# Altium project SUBBOARD-voltage_sensors.PrjPcb (part 1 of 2)
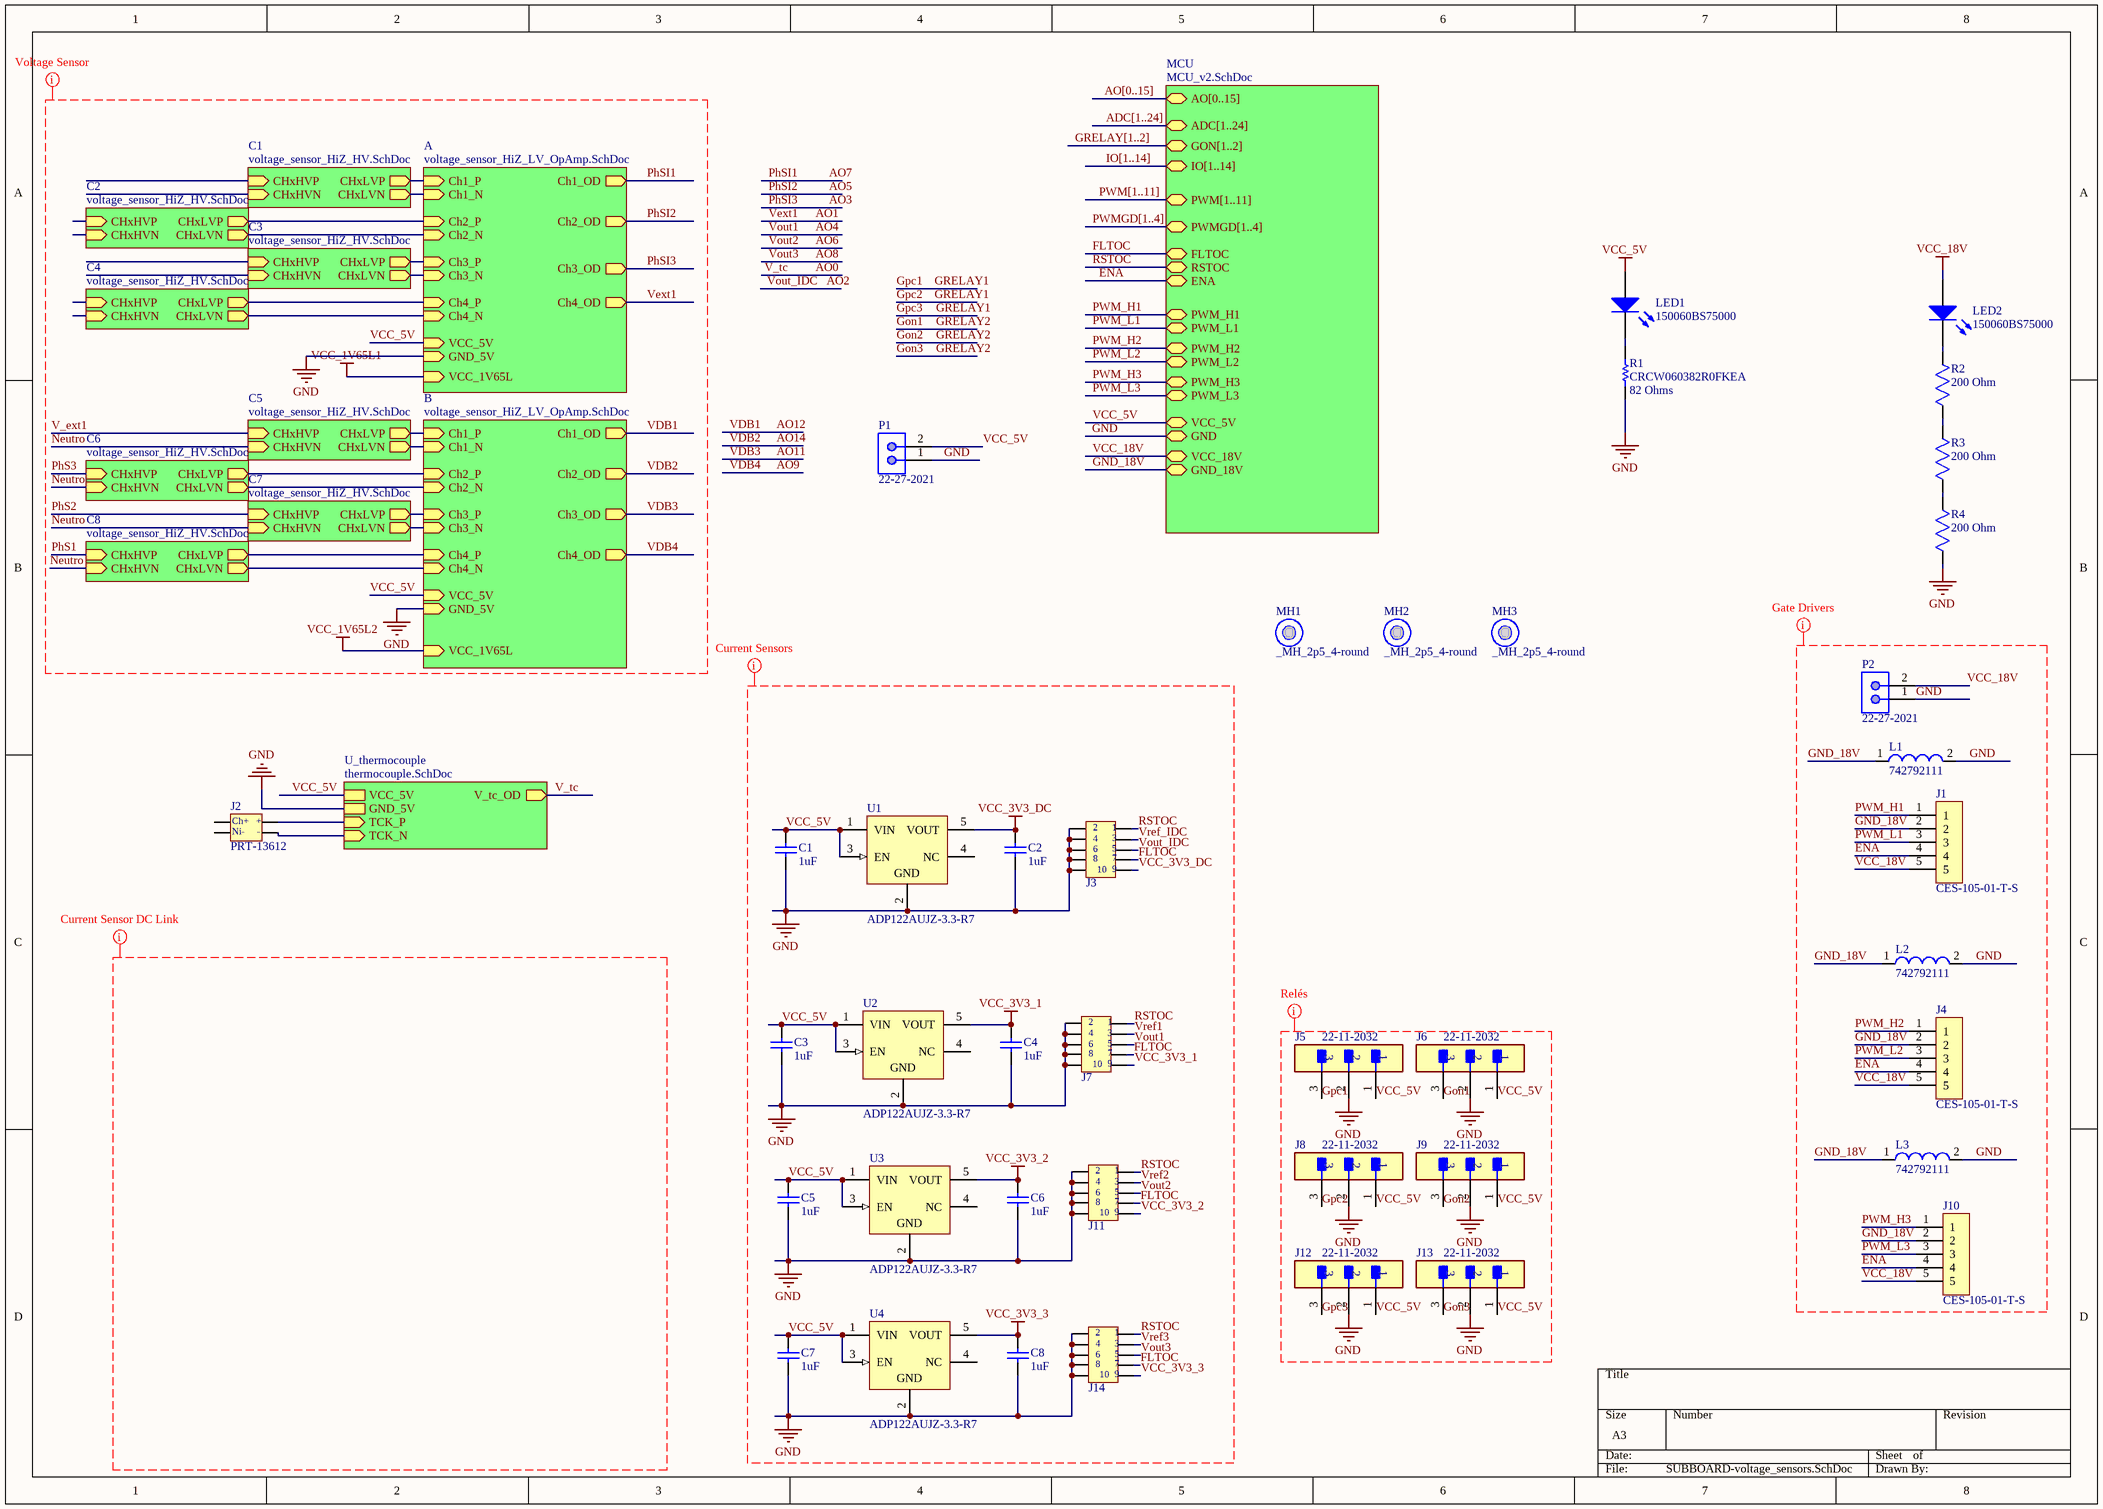
[diagram p0: SUBBOARD-voltage_sensors.SchDoc]
5 sheets, 236 parts. Net scope: hierarchical (ports join the sheet entries above them; power ports are global).
Board file: SUBBOARD-voltage_sensors.PcbDoc
Sheets:
  SUBBOARD-voltage_sensors.SchDoc
    A = voltage_sensor_HiZ_LV_OpAmp.SchDoc
    C1 = voltage_sensor_HiZ_HV.SchDoc
    C2 = voltage_sensor_HiZ_HV.SchDoc
    C3 = voltage_sensor_HiZ_HV.SchDoc
    C4 = voltage_sensor_HiZ_HV.SchDoc
    C5 = voltage_sensor_HiZ_HV.SchDoc
    C6 = voltage_sensor_HiZ_HV.SchDoc
    C7 = voltage_sensor_HiZ_HV.SchDoc
    C8 = voltage_sensor_HiZ_HV.SchDoc
    B = voltage_sensor_HiZ_LV_OpAmp.SchDoc
    MCU = MCU_v2.SchDoc
    U_thermocouple = thermocouple.SchDoc

## Sheet SUBBOARD-voltage_sensors.SchDoc
size A3

### Parts
C1  value 1uF  [CAPC0603(1608)100_N]  (hidden comment: CAP 1uF 50V 0603(1608))
C2  value 1uF  [CAPC0603(1608)100_N]  (hidden comment: CAP 1uF 50V 0603(1608))
C3  value 1uF  [CAPC0603(1608)100_N]  (hidden comment: CAP 1uF 50V 0603(1608))
C4  value 1uF  [CAPC0603(1608)100_N]  (hidden comment: CAP 1uF 50V 0603(1608))
C5  value 1uF  [CAPC0603(1608)100_N]  (hidden comment: CAP 1uF 50V 0603(1608))
C6  value 1uF  [CAPC0603(1608)100_N]  (hidden comment: CAP 1uF 50V 0603(1608))
C7  value 1uF  [CAPC0603(1608)100_N]  (hidden comment: CAP 1uF 50V 0603(1608))
C8  value 1uF  [CAPC0603(1608)100_N]  (hidden comment: CAP 1uF 50V 0603(1608))
J1  CES-105-01-T-S  [CES-105-01-T-S]
J2  PRT-13612  [PRT-13612]
J3  0878311020  [0878311020]  (value not drawn)
J4  CES-105-01-T-S  [CES-105-01-T-S]
J5  22-11-2032  [FP-22-11-2032-MFG]
J6  22-11-2032  [FP-22-11-2032-MFG]
J7  0878311020  [0878311020]  (value not drawn)
J8  22-11-2032  [FP-22-11-2032-MFG]
J9  22-11-2032  [FP-22-11-2032-MFG]
J10  CES-105-01-T-S  [CES-105-01-T-S]
J11  0878311020  [0878311020]  (value not drawn)
J12  22-11-2032  [FP-22-11-2032-MFG]
J13  22-11-2032  [FP-22-11-2032-MFG]
J14  0878311020  [0878311020]  (value not drawn)
L1  742792111  [SMD-1206]
L2  742792111  [SMD-1206]
L3  742792111  [SMD-1206]
LED1  150060BS75000  [0603_A]
LED2  150060BS75000  [0603_A]
MH1  _MH_2p5_4-round  [_MH_2p5_4-round]
MH2  _MH_2p5_4-round  [_MH_2p5_4-round]
MH3  _MH_2p5_4-round  [_MH_2p5_4-round]
P1  22-27-2021  [MOLX-22-27-2021_V]
P2  22-27-2021  [MOLX-22-27-2021_V]
R1  CRCW060382R0FKEA  value 82 Ohms  [RESC1609X50X30LL10T20]
R2  200 Ohm  [CRCW0603200RFKEAHP]
R3  200 Ohm  [CRCW0603200RFKEAHP]
R4  200 Ohm  [CRCW0603200RFKEAHP]
U1  ADP122AUJZ-3.3-R7  [ADI-UJ-5_N]
U2  ADP122AUJZ-3.3-R7  [ADI-UJ-5_N]
U3  ADP122AUJZ-3.3-R7  [ADI-UJ-5_N]
U4  ADP122AUJZ-3.3-R7  [ADI-UJ-5_N]

### Sub-sheets
A = voltage_sensor_HiZ_LV_OpAmp.SchDoc: VCC_5V (in), GND_5V (in), Ch1_OD (out), Ch2_OD (out), Ch3_OD (out), Ch4_OD (out), Ch1_N (in), Ch1_P (in), Ch2_N (in), Ch2_P (in), Ch3_N (in), Ch3_P (in), Ch4_N (in), Ch4_P (in), VCC_1V65L (in)
B = voltage_sensor_HiZ_LV_OpAmp.SchDoc: VCC_5V (in), GND_5V (in), Ch1_OD (out), Ch2_OD (out), Ch3_OD (out), Ch4_OD (out), Ch1_N (in), Ch1_P (in), Ch2_N (in), Ch2_P (in), Ch3_N (in), Ch3_P (in), Ch4_N (in), Ch4_P (in), VCC_1V65L (in)
C1 = voltage_sensor_HiZ_HV.SchDoc: CHxLVP (out), CHxHVN (in), CHxLVN (out), CHxHVP (in)
C2 = voltage_sensor_HiZ_HV.SchDoc: CHxLVP (out), CHxHVN (in), CHxLVN (out), CHxHVP (in)
C3 = voltage_sensor_HiZ_HV.SchDoc: CHxLVP (out), CHxHVN (in), CHxLVN (out), CHxHVP (in)
C4 = voltage_sensor_HiZ_HV.SchDoc: CHxLVP (out), CHxHVN (in), CHxLVN (out), CHxHVP (in)
C5 = voltage_sensor_HiZ_HV.SchDoc: CHxLVP (out), CHxHVN (in), CHxLVN (out), CHxHVP (in)
C6 = voltage_sensor_HiZ_HV.SchDoc: CHxLVP (out), CHxHVN (in), CHxLVN (out), CHxHVP (in)
C7 = voltage_sensor_HiZ_HV.SchDoc: CHxLVP (out), CHxHVN (in), CHxLVN (out), CHxHVP (in)
C8 = voltage_sensor_HiZ_HV.SchDoc: CHxLVP (out), CHxHVN (in), CHxLVN (out), CHxHVP (in)
MCU = MCU_v2.SchDoc: ADC[1..24] (bidir), IO[1..14] (bidir), PWM[1..11] (bidir), PWMGD[1..4] (bidir), ENA (bidir), PWM_H1 (bidir), PWM_L1 (bidir), PWM_H2 (bidir), PWM_L2 (bidir), PWM_H3 (bidir), PWM_L3 (bidir), VCC_5V (bidir), GND (bidir), VCC_18V (bidir), GND_18V (bidir), RSTOC (bidir), FLTOC (bidir), AO[0..15] (bidir), GON[1..2] (bidir)
U_thermocouple = thermocouple.SchDoc: V_tc_OD (out), VCC_5V, GND_5V, TCK_P (in), TCK_N (in)

### Nets
GND: C1.1 C2.1 C3.1 C4.1 C5.1 C6.1 C7.1 C8.1 J3.2 J3.4 J3.6 J3.8 J3.10 J5.2 J6.2 J7.2 J7.4 J7.6 J7.8 J7.10 J8.2 J9.2 J11.2 J11.4 J11.6 J11.8 J11.10 J12.2 J13.2 J14.2 J14.4 J14.6 J14.8 J14.10 L1.2 L2.2 L3.2 P1.1 P2.1 R1.2 R4.1 U1.2(GND) U2.2(GND) U3.2(GND) U4.2(GND) ; sheet A/GND_5V, sheet B/GND_5V, sheet MCU/GND, sheet U_thermocouple/GND_5V
VCC_1V65L1: sheet A/VCC_1V65L, sheet B/VCC_1V65L  [also labelled VCC_1V65L2]  [project net VCC_1V65L]
VCC_3V3_1: C4.2 J7.9 U2.5(VOUT)
VCC_3V3_2: C6.2 J11.9 U3.5(VOUT)
VCC_3V3_3: C8.2 J14.9 U4.5(VOUT)
VCC_3V3_DC: C2.2 J3.9 U1.5(VOUT)
VCC_5V: C1.2 C3.2 C5.2 C7.2 J5.1 J6.1 J8.1 J9.1 J12.1 J13.1 LED1.2(A) P1.2 U1.1(VIN) U1.3(EN) U2.1(VIN) U2.3(EN) U3.1(VIN) U3.3(EN) U4.1(VIN) U4.3(EN) ; sheet A/VCC_5V, sheet B/VCC_5V, sheet MCU/VCC_5V, sheet U_thermocouple/VCC_5V
VCC_18V: J1.5 J4.5 J10.5 LED2.2(A) P2.2 ; sheet MCU/VCC_18V
AO2: J3.5  [also labelled Vout_IDC]
AO4: J7.5  [also labelled Vout1]
AO6: J11.5  [also labelled Vout2]
AO8: J14.5  [also labelled Vout3]
Ch1_N: sheet A/Ch1_N, sheet C1/CHxLVN
Ch1_N: sheet C5/CHxLVN, sheet B/Ch1_N  [a separate net that carries the same name]
Ch1_P: sheet A/Ch1_P, sheet C1/CHxLVP
Ch1_P: sheet C5/CHxLVP, sheet B/Ch1_P  [a separate net that carries the same name]
Ch2_N: sheet A/Ch2_N, sheet C2/CHxLVN
Ch2_N: sheet C6/CHxLVN, sheet B/Ch2_N  [a separate net that carries the same name]
Ch2_P: sheet A/Ch2_P, sheet C2/CHxLVP
Ch2_P: sheet C6/CHxLVP, sheet B/Ch2_P  [a separate net that carries the same name]
Ch3_N: sheet A/Ch3_N, sheet C3/CHxLVN
Ch3_N: sheet C7/CHxLVN, sheet B/Ch3_N  [a separate net that carries the same name]
Ch3_P: sheet A/Ch3_P, sheet C3/CHxLVP
Ch3_P: sheet C7/CHxLVP, sheet B/Ch3_P  [a separate net that carries the same name]
Ch4_N: sheet A/Ch4_N, sheet C4/CHxLVN
Ch4_N: sheet C8/CHxLVN, sheet B/Ch4_N  [a separate net that carries the same name]
Ch4_P: sheet A/Ch4_P, sheet C4/CHxLVP
Ch4_P: sheet C8/CHxLVP, sheet B/Ch4_P  [a separate net that carries the same name]
ENA: J1.4 J4.4 J10.4 ; sheet MCU/ENA
FLTOC: J3.7 J7.7 J11.7 J14.7 ; sheet MCU/FLTOC
GND_18V: J1.2 J4.2 J10.2 L1.1 L2.1 L3.1 ; sheet MCU/GND_18V
Gon1: J6.3 J9.3 J13.3  [also labelled Gon2, Gon3, GRELAY2]
Gpc1: J5.3 J8.3 J12.3  [also labelled Gpc2, Gpc3, GRELAY1]  [project net GON1]
Neutro: sheet C5/CHxHVN, sheet C6/CHxHVN, sheet C7/CHxHVN, sheet C8/CHxHVN
PWM_H1: J1.1 ; sheet MCU/PWM_H1
PWM_H2: J4.1 ; sheet MCU/PWM_H2
PWM_H3: J10.1 ; sheet MCU/PWM_H3
PWM_L1: J1.3 ; sheet MCU/PWM_L1
PWM_L2: J4.3 ; sheet MCU/PWM_L2
PWM_L3: J10.3 ; sheet MCU/PWM_L3
RSTOC: J3.1 J7.1 J11.1 J14.1 ; sheet MCU/RSTOC
TCK_N: J2.4 ; sheet U_thermocouple/TCK_N
TCK_P: J2.3 ; sheet U_thermocouple/TCK_P
Vref1: J7.3
Vref2: J11.3
Vref3: J14.3
Vref_IDC: J3.3
NetLED1_1: LED1.1(K) R1.1
NetLED2_1: LED2.1(K) R2.2
NetR2_1: R2.1 R3.2
NetR3_1: R3.1 R4.2

Not connected (* = marked no-connect by the designer): J2 1 2; U1 4(NC); U2 4(NC); U3 4(NC); U4 4(NC)

### Buses and harness runs
bus ADC[1..24] = sheet MCU/ADC[1..24]
bus AO[0..15] = sheet MCU/AO[0..15]
bus GRELAY[1..2] = sheet MCU/GON[1..2]
bus IO[1..14] = sheet MCU/IO[1..14]
bus PWM[1..11] = sheet MCU/PWM[1..11]
bus PWMGD[1..4] = sheet MCU/PWMGD[1..4]

### Layout directives
mark named Current Sensors: FLTOC, GND, RSTOC, VCC_3V3_1, VCC_3V3_2, VCC_3V3_3, VCC_3V3_DC, VCC_5V, Vout1, Vout2, Vout3, Vout_IDC, Vref1, Vref2, Vref3, Vref_IDC
mark named Relés: GND, Gon1, Gon2, Gon3, Gpc1, Gpc2, Gpc3, VCC_5V
mark named Current Sensor DC Link: (no net found under the mark)
mark named Voltage Sensor: GND, Neutro, PhS1, PhS2, PhS3, PhSI1, PhSI2, PhSI3, V_ext1, VCC_1V65L1, VCC_1V65L2, VCC_5V, VDB1, VDB2, VDB3, VDB4, Vext1
mark named Gate Drivers: ENA, GND, GND_18V, PWM_H1, PWM_H2, PWM_H3, PWM_L1, PWM_L2, PWM_L3, VCC_18V

### Notes on the sheet
- (in symbol PRT-13612) Ch+; +; Ni-; -

### Library data of the parts
C1-C8 = CMP-1035-02746-1: CAP 1uF 50V ±20% 0603 (1608 Metric) Thickness 1mm SMD; Tolerance: Â±20%; Case-EIA: 0603; Case-Metric: 1608; Technology: SMT; Max Thickness: 1 mm; Rated Voltage: 50 V
J1 J4 J10 = CES-105-01-T-S: SAMTEC         CES-105-01-T-S             Board-To-Board Connector, CES Series, 5 Contacts, Receptacle, 2.54 mm, Through Hole, 1 Rows; Number of Contacts: 5; Contact Resistance: 10mR; Max Current Rating: 1A; Max Voltage Rating (AC): 400V; Pitch: 2.54mm; Manufacturer: Samtec; Manufacturer Part Number: CES-105-01-T-S; RoHS: Yes; Category: Connectors; Stock 1: 235; Pricing 1: 1=0,57000, 10=0,53600, 25=0,48280, 50=0,42920, 100=0,41120, 250=0,37548, 500=0,35760 (USD); Mount: Through Hole; Contact Plating: Tin; Housing Color: Black; Contact Material: Bronze; Color: Black; Housing Material: Polyester; Min Operating Temperature: -55°C; Max Operating Temperature: 105°C; Number of Rows: 1; Termination: Solder; Orientation: Straight; Packaging: Bulk; Package Quantity: 1; Connector Type: Receptacle; Number of Positions: 5; Gender: Receptacle; Length: 12.7mm; Depth: 3.05mm; Width: 3.05mm; Radiation Hardening: No; Lead Free: Lead Free; REACH SVHC: No SVHC; ComponentLink1URL: https://datasheet.ciiva.com/413/ces-mkt-413356.pdf?src-supplier=Digi-Key; ComponentLink1Description: https://datasheet.ciiva.com/413/ces-mkt-413356.pdf?src-supplier=Digi-Key; Supplier 1: Digi-Key; Supplier 2: Arrow; Supplier 3: Mouser; Supplier 4: Newark; Supplier Part Number 2: CES-105-01-T-S; Supplier Part Number 3: 200-CES10501TS; Supplier Part Number 4: 11P3506; Supplier Part Number 1: SAM1087-05-ND
J2 = PRT-13612: THERMOCOUPLE CONN - PCC-SMP-K; Manufacturer: SparkFun; System: Connector; Supplier 1: Digi-Key; Manufacturer Part Number: PRT-13612; RoHS: No; Stock 1: 201; Pricing 1: 1=4.38000 (USD); ComponentLink1URL: https://cdn.sparkfun.com/datasheets/Prototyping/PCC-SMP-K-datasheet.pdf?src-supplier=Digi-Key; ComponentLink1Description: https://cdn.sparkfun.com/datasheets/Prototyping/PCC-SMP-K-datasheet.pdf?src-supplier=Digi-Key; Supplier Part Number 1: 1568-1306-ND
J3 J7 J11 J14 = 0878311020: Conn Shrouded Header HDR 10 POS 2mm Solder ST Thru-Hole Milli-Grid™ Tube; Manufacturer: Molex; Number of Positions: 10; Connector Type: Male Pin; Row Spacing: 0.079inch; Supplier 1: Digi-Key; Manufacturer Part Number: 0878311020; RoHS: Yes; Category: Headers and Wire Housings; Stock 1: 7937; Pricing 1: 1=1.65000, 10=1.50100, 100=1.28650, 500=1.07206, 1000=0.91890, 5000=0.81476, 10000=0.79638 (USD); Mount: Through Hole; Contact Plating: Gold; Contact Material: Bronze; Color: Black; Housing Material: Nylon; Housing Color: Black; Min Operating Temperature: -55°C; Max Operating Temperature: 105°C; Termination: Solder; Number of Contacts: 10; Number of Rows: 2; Packaging: Rail/Tube; Orientation: Straight; Length: 12.65mm; Pitch: 2mm; Contact Mating Length: 0.141inch; Depth: 6.3mm; Radiation Hardening: No; ComponentLink1URL: https://datasheet.ciiva.com/6814/878311620-sd-6814006.pdf?src-supplier=Digi-Key; ComponentLink1Description: https://datasheet.ciiva.com/6814/878311620-sd-6814006.pdf?src-supplier=Digi-Key; Supplier Part Number 1: WM18560-ND
J5 J6 J8 J9 J12 J13 = CMP-04776-000113-1: CONN HEADER VERT 3POS 2.54MM; Manufacturer: Molex; Number Of Contacts: 3; Voltage Rating: 500V; Conn Gender: Male; Current Rating: 4A; Conn Orientation: Vertical; Device Class L2: Headers and Wire Housings; Number Of Rows: 1; Temperature Range High: +80°C; RoHS: TRUE; ComponentLink2URL: https://www.molex.com/webdocs/datasheets/pdf/en-us/0022112032_PCB_HEADERS.pdf; Manufacturer Part Number: 22-11-2032; Device Class L3: unset; Automotive: No; Temperature: -40°C to +80°C; Temperature Range Low: -40°C; Lead Free: Yes; Pitch: 2.54mm; Footprint Url: https://www.molex.com/pdm_docs/sd/022112032_sd.pdf; Digikey Description: CONN HEADER VERT 3POS 2.54MM; Contact Material: Gold,Nickel; Octopart: https://octopart.com/22-11-2032-molex-10085; Height: 10.91mm; Mouser Description: KK® 254 Solid Header, Vertical, with Friction Lock, 3 Circuits, Gold (Au) Plating; Package: 22-11-2032; Device Class L1: Connectors; Mounting Type: Through Hole; ComponentLink2Description: Datasheet; Category: Conn
L1-L3 = CMP-0220-00024-1: SMD EMI Suppression Ferrite Bead WE-CBF, Z = 26 Ohm; Impedance: 26 Ohm; ComponentLink2Description: Datasheet; PackageReference: SMD-1206; ComponentLink2URL: http://www.we-online.de/katalog/media/pdf/742792111.pdf; PackageVersion: 2007; DatasheetVersion: Dec-2005; PackageDescription: Chip Inductor, 2-Leads, Body 3.2 x 1.6 mm; ComponentLink1URL: http://www.we-online.com; ComponentLink1Description: Manufacturer Link
LED1 LED2 = CMP-1426-00003-1: SMD mono-color Chip LED, WL-SMCW, Blue; Manufacturer: Wuerth Elektronik; Color: Blue; ComponentLink2Description: Datasheet; ComponentLink2URL: http://katalog.we-online.com/led/datasheet/150060BS75000.pdf; ComponentLink1URL: http://www.we-online.com; PackageReference: 0603_A; PartNumber: 150060BS75000; ComponentLink1Description: Manufacturer URL
MH1-MH3 = _MH_2p5_4-round: matching hole 2.5 hole, 4mm pad (round)
P1 P2 = CMP-2000-05537-1: Male Header, Pitch 2.54 mm, 1 x 2 Position, Height 11.7 mm, Tail Length 3.56 mm, 0 to 75 degC, RoHS, Bulk; Manufacturer: Molex; PartNumber: 0022272021; Current rating: 4A; Package Version: Rev. BC, 02/2012; Voltage rating: 250V; No. of Positions: 2; Pitch: 2.54mm; No. of Rows: 1; Orientation: Vertical; Operating temperature: 0°Cto+75°C; Manufacturer URL: http://www.molex.com/; Mounting Technology: ThroughHole; Housing material: Nylon(UL94V-0); Package Description: 2-Leads Header, Body 5.08 x 5.8 mm, Pitch 2.54 mm; Voltage - Max: 250V; Datasheet URL: http://www.molex.com/pdm_docs/sd/022272021_sd.pdf; Package Reference: 22-27-2021; Contact material: Tinplatedbrass; Current - Max: 4A; Datasheet Version: Rev. F, 06/2009
R1 = CMP-2000-03606-1: Manufacturer: Vishay Dale; Part Number: CRCW060382R0FKEA
R2-R4 = CRCW0603200RFKEAHP: CRCW0603200RFKEAHP / Res Thick Film 0603 200 Ohm 1% 0.25W(1/4W) ±100ppm/C Pad SMD Automotive T/R; Manufacturer: Vishay Dale; Resistance: 200R; Power Rating: 250mW; Temperature Coefficient: 100ppm/°C; Supplier 1: Digi-Key; Manufacturer Part Number: CRCW0603200RFKEAHP; RoHS: Yes; Category: Chip SMD Resistors; Stock 1: 59007; Pricing 1: 1=0.15000, 10=0.12900, 100=0.05030, 1000=0.02106, 2500=0.01930 (USD); Mount: Surface Mount; Case/Package: 0603; Case Code (Imperial): 0603; Case Code (Metric): 1608; Contact Plating: Tin; Min Operating Temperature: -55°C; Max Operating Temperature: 155°C; Features: Automotive AEC-Q200; Tolerance: 1%; Packaging: Tape and Reel; Resistor Type: Thick Film; Max Power Dissipation: 250mW; Number of Terminations: 2; Package Quantity: 5000; Length: 0.063inch; Width: 0.033inch; Height: 0.022inch; Radiation Hardening: No; Lead Free: Lead Free; ComponentLink1URL: https://datasheet.ciiva.com/2578/crcwhpe3-2578537.pdf?src-supplier=Digi-Key; ComponentLink1Description: https://datasheet.ciiva.com/2578/crcwhpe3-2578537.pdf?src-supplier=Digi-Key; ComponentLink2URL: https://datasheet.ciiva.com/8961/crcwhpe3-8961129.pdf?src-supplier=Avnet; ComponentLink2Description: https://datasheet.ciiva.com/8961/crcwhpe3-8961129.pdf?src-supplier=Avnet; Supplier Part Number 1: 541-200SCT-ND
U1-U4 = CMP-0786-00346-1: 300 mA, Low Quiescent Current, CMOS Linear Regulator, 2.3 to 5.5 V Vin, 3.3 V Vout, Industrial, 5-pin SOT23 (UJ-5), Reel; Manufacturer: Analog Devices; Vin (min) (V): 2.3; Supply Current IGND @ Small Load: 45uA; Vin (max) (V): 5.5; Iout max: 300mA; Preset Vout Values (V): 3.3; ComponentLink4Description: URL Link1; ComponentLink4URL: Product URL:http://www.analog.com/en/ADP122/productSearch.html; ComponentLink2URL: http://www.analog.com/static/imported-files/data_sheets/ADP122_123.pdf; PackageDescription: 5-Pin Thin Small Outline Transistor Package, Body 2.9 x 1.6 mm, Pitch 0.95 mm; ComponentLink1URL: http://www.analog.com/en/index.html; ComponentLink3URL: http:/www.analog.com/static/imported-files/packages/PKG_PDF/TSOT(UJ)/UJ_5.pdf; ComponentLink2Description: Datasheet; PartNumber: ADP122AUJZ-3.3-R7; Packing: Reel; ComponentLink1Description: Manufacturer URL; Code_JEDEC: MO-193-AB; PackageVersion: 100708-A, 10/2008; PackageReference: UJ-5; Mounting Technology: Surface Mount; DatasheetVersion: Rev. E; ComponentLink3Description: Package Specification

## Sheet voltage_sensor_HiZ_LV_OpAmp.SchDoc
size A4
Used 2 times, as channels A, B. Parts and nets are listed once, with the designators drawn on the sheet.
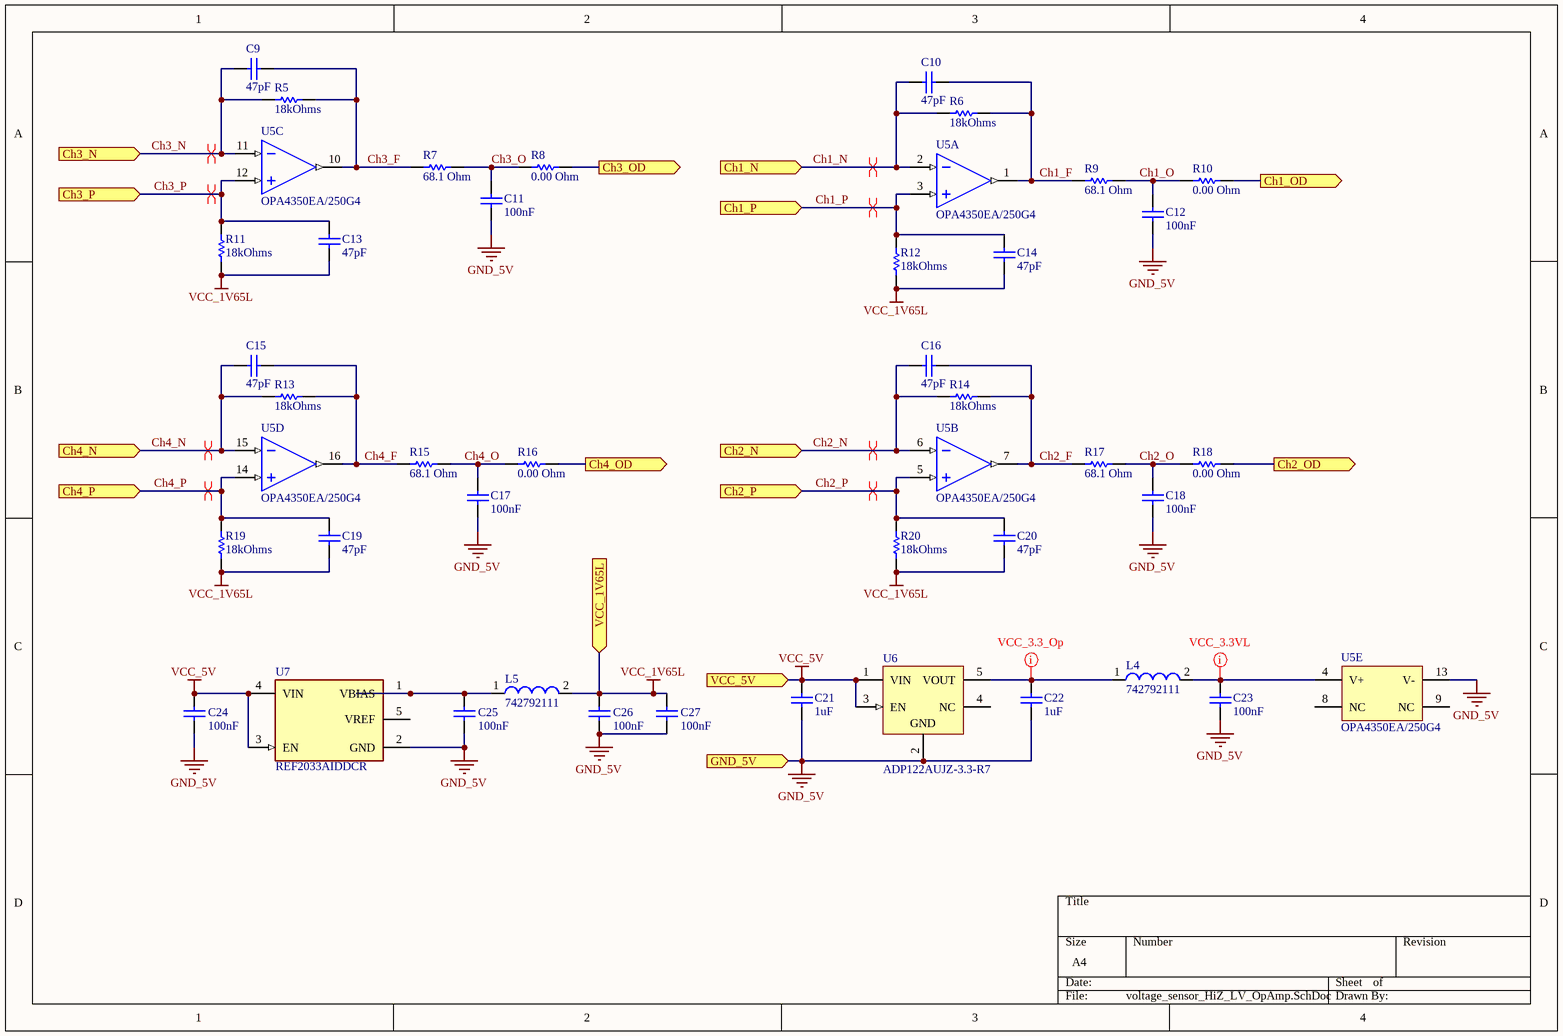
[diagram p1: voltage_sensor_HiZ_LV_OpAmp.SchDoc]

### Parts
C9  value 47pF  [CAPC0603(1608)100_L]  (hidden comment: CAP 47pF 50V 0603(1608))
C10  value 47pF  [CAPC0603(1608)100_L]  (hidden comment: CAP 47pF 50V 0603(1608))
C11  value 100nF  [CAPC0603(1608)100_L]  (hidden comment: CAP 100nF 10V 0603(1608))
C12  value 100nF  [CAPC0603(1608)100_L]  (hidden comment: CAP 100nF 10V 0603(1608))
C13  value 47pF  [CAPC0603(1608)100_L]  (hidden comment: CAP 47pF 50V 0603(1608))
C14  value 47pF  [CAPC0603(1608)100_L]  (hidden comment: CAP 47pF 50V 0603(1608))
C15  value 47pF  [CAPC0603(1608)100_L]  (hidden comment: CAP 47pF 50V 0603(1608))
C16  value 47pF  [CAPC0603(1608)100_L]  (hidden comment: CAP 47pF 50V 0603(1608))
C17  value 100nF  [CAPC0603(1608)100_L]  (hidden comment: CAP 100nF 10V 0603(1608))
C18  value 100nF  [CAPC0603(1608)100_L]  (hidden comment: CAP 100nF 10V 0603(1608))
C19  value 47pF  [CAPC0603(1608)100_L]  (hidden comment: CAP 47pF 50V 0603(1608))
C20  value 47pF  [CAPC0603(1608)100_L]  (hidden comment: CAP 47pF 50V 0603(1608))
C21  value 1uF  [CAPC0603(1608)100_N]  (hidden comment: CAP 1uF 50V 0603(1608))
C22  value 1uF  [CAPC0603(1608)100_N]  (hidden comment: CAP 1uF 50V 0603(1608))
C23  value 100nF  [CAPC0603(1608)100_L]  (hidden comment: CAP 100nF 10V 0603(1608))
C24  value 100nF  [CAPC0603(1608)100_N]  (hidden comment: CAP 100nF 10V 0603(1608))
C25  value 100nF  [CAPC0603(1608)100_N]  (hidden comment: CAP 100nF 10V 0603(1608))
C26  value 100nF  [CAPC0603(1608)100_L]  (hidden comment: CAP 100nF 10V 0603(1608))
C27  value 100nF  [CAPC0603(1608)100_L]  (hidden comment: CAP 100nF 10V 0603(1608))
L4  742792111  [SMD-1206]
L5  742792111  [SMD-1206]
R5  Resistance: 18kOhms  [RESC1608X55X25LL10T15]  (hidden comment: RC0603FR-0718KL)
R6  Resistance: 18kOhms  [RESC1608X55X25LL10T15]  (hidden comment: RC0603FR-0718KL)
R7  value 68.1 Ohm  [RESC1608X55X30LL15T15]  (hidden comment: ERJ-3EKF68R1V)
R8  value 0.00 Ohm  [RESC0603(1608)_L]  (hidden comment: Jumper 0603(1608))
R9  value 68.1 Ohm  [RESC1608X55X30LL15T15]  (hidden comment: ERJ-3EKF68R1V)
R10  value 0.00 Ohm  [RESC0603(1608)_L]  (hidden comment: Jumper 0603(1608))
R11  Resistance: 18kOhms  [RESC1608X55X25LL10T15]  (hidden comment: RC0603FR-0718KL)
R12  Resistance: 18kOhms  [RESC1608X55X25LL10T15]  (hidden comment: RC0603FR-0718KL)
R13  Resistance: 18kOhms  [RESC1608X55X25LL10T15]  (hidden comment: RC0603FR-0718KL)
R14  Resistance: 18kOhms  [RESC1608X55X25LL10T15]  (hidden comment: RC0603FR-0718KL)
R15  value 68.1 Ohm  [RESC1608X55X30LL15T15]  (hidden comment: ERJ-3EKF68R1V)
R16  value 0.00 Ohm  [RESC0603(1608)_L]  (hidden comment: Jumper 0603(1608))
R17  value 68.1 Ohm  [RESC1608X55X30LL15T15]  (hidden comment: ERJ-3EKF68R1V)
R18  value 0.00 Ohm  [RESC0603(1608)_L]  (hidden comment: Jumper 0603(1608))
R19  Resistance: 18kOhms  [RESC1608X55X25LL10T15]  (hidden comment: RC0603FR-0718KL)
R20  Resistance: 18kOhms  [RESC1608X55X25LL10T15]  (hidden comment: RC0603FR-0718KL)
U5  OPA4350EA/250G4  [TI-DBQ16_L]  (parts A,B,C,D,E of 5)
U6  ADP122AUJZ-3.3-R7  [ADI-UJ-5_N]
U7  REF2033AIDDCR  [FP-DDC0005A-IPC_C]

### Ports
Ch1_N (in), Ch1_OD (out), Ch1_P (in), Ch2_N (in), Ch2_OD (out), Ch2_P (in), Ch3_N (in), Ch3_OD (out), Ch3_P (in), Ch4_N (in), Ch4_OD (out), Ch4_P (in), GND_5V (in), VCC_1V65L (in), VCC_5V (in)

### Nets
GND_5V: C11.1 C12.1 C17.1 C18.1 C21.1 C22.1 C23.1 C24.1 C25.1 C26.1 C27.1 U5.13(V-) U6.2(GND) U7.2(GND) ; port GND_5V
VCC_1V65L: C13.2 C14.2 C19.2 C20.2 C26.2 C27.2 L5.2 R11.2 R12.2 R19.2 R20.2 ; port VCC_1V65L
VCC_5V: C21.2 C24.2 U6.1(VIN) U6.3(EN) U7.3(EN) U7.4(VIN) ; port VCC_5V
Ch1_F: C10.2 R6.1 R9.2 U5.1(OUT_A)
Ch1_N: C10.1 R6.2 U5.2(IN_A-) ; port Ch1_N
Ch1_O: C12.2 R9.1 R10.2
Ch1_OD: R10.1 ; port Ch1_OD
Ch1_P: C14.1 R12.1 U5.3(IN_A+) ; port Ch1_P
Ch2_F: C16.2 R14.1 R17.2 U5.7(OUT_B)
Ch2_N: C16.1 R14.2 U5.6(IN_B-) ; port Ch2_N
Ch2_O: C18.2 R17.1 R18.2
Ch2_OD: R18.1 ; port Ch2_OD
Ch2_P: C20.1 R20.1 U5.5(IN_B+) ; port Ch2_P
Ch3_F: C9.2 R5.1 R7.2 U5.10(OUT_C)
Ch3_N: C9.1 R5.2 U5.11(IN_C-) ; port Ch3_N
Ch3_O: C11.2 R7.1 R8.2
Ch3_OD: R8.1 ; port Ch3_OD
Ch3_P: C13.1 R11.1 U5.12(IN_C+) ; port Ch3_P
Ch4_F: C15.2 R13.1 R15.2 U5.16(OUT_D)
Ch4_N: C15.1 R13.2 U5.15(IN_D-) ; port Ch4_N
Ch4_O: C17.2 R15.1 R16.2
Ch4_OD: R16.1 ; port Ch4_OD
Ch4_P: C19.1 R19.1 U5.14(IN_D+) ; port Ch4_P
NetC22_2: C22.2 L4.1 U6.5(VOUT)
NetC23_2: C23.2 L4.2 U5.4(V+)
NetC25_2: C25.2 L5.1 U7.1(VBIAS)

Not connected (* = marked no-connect by the designer): U5 8(NC) 9(NC); U6 4(NC); U7 5(VREF)

### Channels
A: designators end in A; ports Ch1_N=Ch1_N Ch1_OD=AO7 Ch1_P=Ch1_P Ch2_N=Ch2_N Ch2_OD=AO5 Ch2_P=Ch2_P Ch3_N=Ch3_N Ch3_OD=AO3 Ch3_P=Ch3_P Ch4_N=Ch4_N Ch4_OD=AO1 Ch4_P=Ch4_P GND_5V=GND VCC_1V65L=VCC_1V65L VCC_5V=VCC_5V
B: designators end in B; ports Ch1_N=Ch1_N Ch1_OD=AO12 Ch1_P=Ch1_P Ch2_N=Ch2_N Ch2_OD=AO14 Ch2_P=Ch2_P Ch3_N=Ch3_N Ch3_OD=AO11 Ch3_P=Ch3_P Ch4_N=Ch4_N Ch4_OD=AO9 Ch4_P=Ch4_P GND_5V=GND VCC_1V65L=VCC_1V65L VCC_5V=VCC_5V

### Layout directives
differential pair: Ch1_N, Ch1_P, Ch2_N, Ch2_P, Ch3_N, Ch3_P, Ch4_N, Ch4_P
mark named VCC_3.3_Op: NetC22A_2
mark named VCC_3.3VL: NetC23A_2

### Library data of the parts
C9 C10 C13-C16 C19 C20 = CMP-1035-01063-1: CAP 47pF 50V ±5% 0603 (1608 Metric) Thickness 1mm SMD; Case-EIA: 0603; Tolerance: Â±5%; Case-Metric: 1608; Technology: SMT; Max Thickness: 1 mm; Rated Voltage: 50 V
C11 C12 C17 C18 C23-C27 = CMP-1035-02580-1: CAP 100nF 10V ±10% 0603 (1608 Metric) Thickness 1mm SMD; Tolerance: Â±10%; Case-EIA: 0603; Case-Metric: 1608; Max Thickness: 1 mm; Rated Voltage: 10 V; Technology: SMT
C21 C22 = CMP-1035-02746-1: as C1 on sheet SUBBOARD-voltage_sensors; Technology: SMT; Max Thickness: 1 mm; Rated Voltage: 50 V
L4 L5 = CMP-0220-00024-1: as L1 on sheet SUBBOARD-voltage_sensors; ComponentLink2Description: Datasheet; PackageReference: SMD-1206; ComponentLink2URL: http://www.we-online.de/katalog/media/pdf/742792111.pdf; PackageVersion: 2007; DatasheetVersion: Dec-2005; PackageDescription: Chip Inductor, 2-Leads, Body 3.2 x 1.6 mm; ComponentLink1URL: http://www.we-online.com; ComponentLink1Description: Manufacturer Link
R5 R6 R11-R14 R19 R20 = CMP-2000-06930-1: Chip Resistor, 18 KOhm, +/- 1%, 0.1 W, -55 to 155 degC, 0603 (1608 Metric), RoHS, Tape and Reel; Manufacturer: Yageo; Voltage Rating: 75V; Temperature Coefficient: 100PPM/C; Unit Weight: 0.000071oz; Power Rating: 100mW; Datasheet URL: http://www.yageo.com/documents/recent/PYu-RC_Group_51_RoHS_L_7.pdf; Packaging: Reel; Series: RC; Datasheet Version: Rev. 7, 05/2017; Type: GeneralPurposeChipResistorSurfaceMount; Termination Style: SMD/SMT; Package Reference: 0603; Operating Temperature Range: -55Cto+155C; Mounting Technology: SurfaceMount; Tolerance: 1%; Height: 0.45mm; Length: 1.6mm; Case Code - mm: 1608; Product: ThickFilmResistorsGeneralPurpose; RoHS: True; Product Category: ThickFilmResistors; Case Code - in: 0603; Brand: Yageo; Manufacturer URL: http://www.yageo.com/; Width: 0.8mm; Package / Case: 0603(1608metric); Package Description: 2-Pin Surface Mount Device, Body 1.6 x 0.8 mm
R7 R9 R15 R17 = CMP-2000-00621-1: Manufacturer: Panasonic; Tolerance: 1%; Part Number: ERJ-3EKF68R1V; Package: 0603
R8 R10 R16 R18 = CMP-1012-00001-1: Jumper 0603 (1608 Metric); Case-Metric: 1608; Power: None; Case-EIA: 0603; Technology: SMT; Tolerance: None
U5 = CMP-0272-00834-2: High-Speed, Single-Supply, Rail-to-Rail Operational Amplifier MicroAmplifier(TM) Series, 2.7 to 5.5 V, -55 to 150 degC, 16-pin SOP (DBQ16), Green (RoHS & no Sb/Br); Manufacturer: Texas Instruments; Iq per channel(Max)(mA): 7.5; Slew Rate(Typ)(V/us): 22; Sub Family: Low Input Bias Current Amp (<=10pA), Low Offset Voltage Amplifier (<=500uV), Low Supply Voltage Amplifier (<=2.7V), Precision Amplifier; Vn at 1kHz(Typ)(nV/rtHz): 18; CMRR(Min)(dB): 66; Offset Drift(Typ)(uV/C): 4; Vio (25C)(Max)(mV): 0.5; Total Supply Voltage(Min)(+5V is 5, +/-5V is 10): 2.7; IIB(Max)(pA): 10; Total Supply Voltage(Max)(+5V is 5, +/-5V is 10): 5.5; Eco-Plan: Green (RoHS & no Sb/Br); PackageVersion: 4073301-2/H, 10/2008; ComponentLink1Description: Manufacturer URL; ComponentLink2Description: Datasheet; Mounting Technology: Surface Mount; ComponentLink3Description: Package Specification; PackageReference: DBQ16; PartNumber: OPA4350EA/250G4; ComponentLink2URL: http://www.ti.com/general/docs/lit/getliterature.tsp?genericPartNumber=OPA4350&fileType=pdf; ComponentLink1URL: http://www.ti.com/; Code_JEDEC: MO-137; DatasheetVersion: SBOS099C; Number of Channels: 4; ComponentLink3URL: http://www.ti.com/litv/pdf/msoi004g; PackageDescription: 16-Pin, Plastic Small Outline, Body 3.9 x 4.9 mm, Pitch 0.635 mm
U6 = CMP-0786-00346-1: as U1 on sheet SUBBOARD-voltage_sensors; ComponentLink4Description: URL Link1; ComponentLink4URL: Product URL:http://www.analog.com/en/ADP122/productSearch.html; ComponentLink2URL: http://www.analog.com/static/imported-files/data_sheets/ADP122_123.pdf; PackageDescription: 5-Pin Thin Small Outline Transistor Package, Body 2.9 x 1.6 mm, Pitch 0.95 mm; ComponentLink1URL: http://www.analog.com/en/index.html; ComponentLink3URL: http:/www.analog.com/static/imported-files/packages/PKG_PDF/TSOT(UJ)/UJ_5.pdf; ComponentLink2Description: Datasheet; PartNumber: ADP122AUJZ-3.3-R7; Packing: Reel; ComponentLink1Description: Manufacturer URL; Code_JEDEC: MO-193-AB; PackageVersion: 100708-A, 10/2008; PackageReference: UJ-5; Mounting Technology: Surface Mount; DatasheetVersion: Rev. E; ComponentLink3Description: Package Specification
U7 = CMP-04916-000008-1: IC VREF SERIES 1.65V/3.3V 5SOT; Manufacturer: Texas Instruments; Standoff Height: 0mm; Nominal Supply Current: 360uA; Min Supply Voltage: 3.32V; Output Type: Fixed; Number Of Outputs: 2; Output Voltage: 1.65/3.3V; Output Current: 20mA; Max Supply Voltage: 5.5V; Max Junction Temp: +150°C; Automotive: No; Height: 1.1mm; Package: DDC0005A; Reference Type: Series; Manufacturer Part Number: REF2033AIDDCR; Temperature Range High: +125°C; Lead Free: Yes; ComponentLink2Description: Datasheet; Device Class L1: Integrated Circuits (ICs); Category: IC; RoHS: TRUE; Device Class L3: Voltage References; ComponentLink2URL: http://www.ti.com/lit/ds/symlink/ref2033.pdf; Device Class L2: Power Management ICs; Octopart: https://octopart.com/ref2033aiddcr-texas+instruments-46921199; Digikey Description: IC VREF SERIES 1.65V/3.3V 5SOT; Temperature: -40°C to +125°C; Temperature Range Low: -40°C

## Sheet voltage_sensor_HiZ_HV.SchDoc
size A3
Used 8 times, as channels C1, C2, C3, C4, C5, C6, C7, C8. Parts and nets are listed once, with the designators drawn on the sheet.
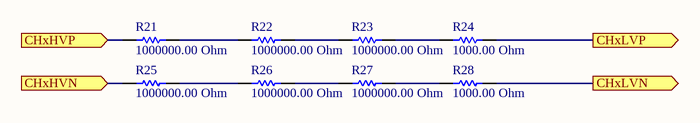
[diagram p2: voltage_sensor_HiZ_HV.SchDoc]

### Parts
R21  value 1000000.00 Ohm  [RESC1206(3216)_L]  (hidden comment: 1M 1% 1206(3216))
R22  value 1000000.00 Ohm  [RESC1206(3216)_L]  (hidden comment: 1M 1% 1206(3216))
R23  value 1000000.00 Ohm  [RESC1206(3216)_L]  (hidden comment: 1M 1% 1206(3216))
R24  value 1000.00 Ohm  [RESC1206(3216)_L]  (hidden comment: 1K 1% 1206(3216))
R25  value 1000000.00 Ohm  [RESC1206(3216)_L]  (hidden comment: 1M 1% 1206(3216))
R26  value 1000000.00 Ohm  [RESC1206(3216)_L]  (hidden comment: 1M 1% 1206(3216))
R27  value 1000000.00 Ohm  [RESC1206(3216)_L]  (hidden comment: 1M 1% 1206(3216))
R28  value 1000.00 Ohm  [RESC1206(3216)_L]  (hidden comment: 1K 1% 1206(3216))

### Ports
CHxHVN (in), CHxHVP (in), CHxLVN (out), CHxLVP (out)

### Nets
CHxHVN: R25.2 ; port CHxHVN
CHxHVP: R21.2 ; port CHxHVP
CHxLVN: R28.1 ; port CHxLVN
CHxLVP: R24.1 ; port CHxLVP
NetR21_1: R21.1 R22.2
NetR22_1: R22.1 R23.2
NetR23_1: R23.1 R24.2
NetR25_1: R25.1 R26.2
NetR26_1: R26.1 R27.2
NetR27_1: R27.1 R28.2

### Channels
C1: designators end in A; ports CHxHVN=NetR25A_2 CHxHVP=NetR21A_2 CHxLVN=Ch1_N CHxLVP=Ch1_P
C2: designators end in B; ports CHxHVN=NetR25B_2 CHxHVP=NetR21B_2 CHxLVN=Ch2_N CHxLVP=Ch2_P
C3: designators end in C; ports CHxHVN=NetR25C_2 CHxHVP=NetR21C_2 CHxLVN=Ch3_N CHxLVP=Ch3_P
C4: designators end in D; ports CHxHVN=NetR25D_2 CHxHVP=NetR21D_2 CHxLVN=Ch4_N CHxLVP=Ch4_P
C5: designators end in E; ports CHxHVN=Neutro CHxHVP=V_ext1 CHxLVN=Ch1_N CHxLVP=Ch1_P
C6: designators end in F; ports CHxHVN=Neutro CHxHVP=PhS3 CHxLVN=Ch2_N CHxLVP=Ch2_P
C7: designators end in G; ports CHxHVN=Neutro CHxHVP=PhS2 CHxLVN=Ch3_N CHxLVP=Ch3_P
C8: designators end in H; ports CHxHVN=Neutro CHxHVP=PhS1 CHxLVN=Ch4_N CHxLVP=Ch4_P

### Library data of the parts
R21-R23 R25-R27 = CMP-1014-00849-1: 1M 0.25W 1% 1206 (3216 Metric)  SMD; Case-EIA: 1206; Case-Metric: 3216; Tolerance: 1 %; Power: 0.25 W; Technology: SMT
R24 R28 = CMP-1014-00510-1: 1K 0.25W 1% 1206 (3216 Metric)  SMD; Case-Metric: 3216; Case-EIA: 1206; Power: 0.25 W; Tolerance: 1 %; Technology: SMT

## Sheet MCU_v2.SchDoc
size A3
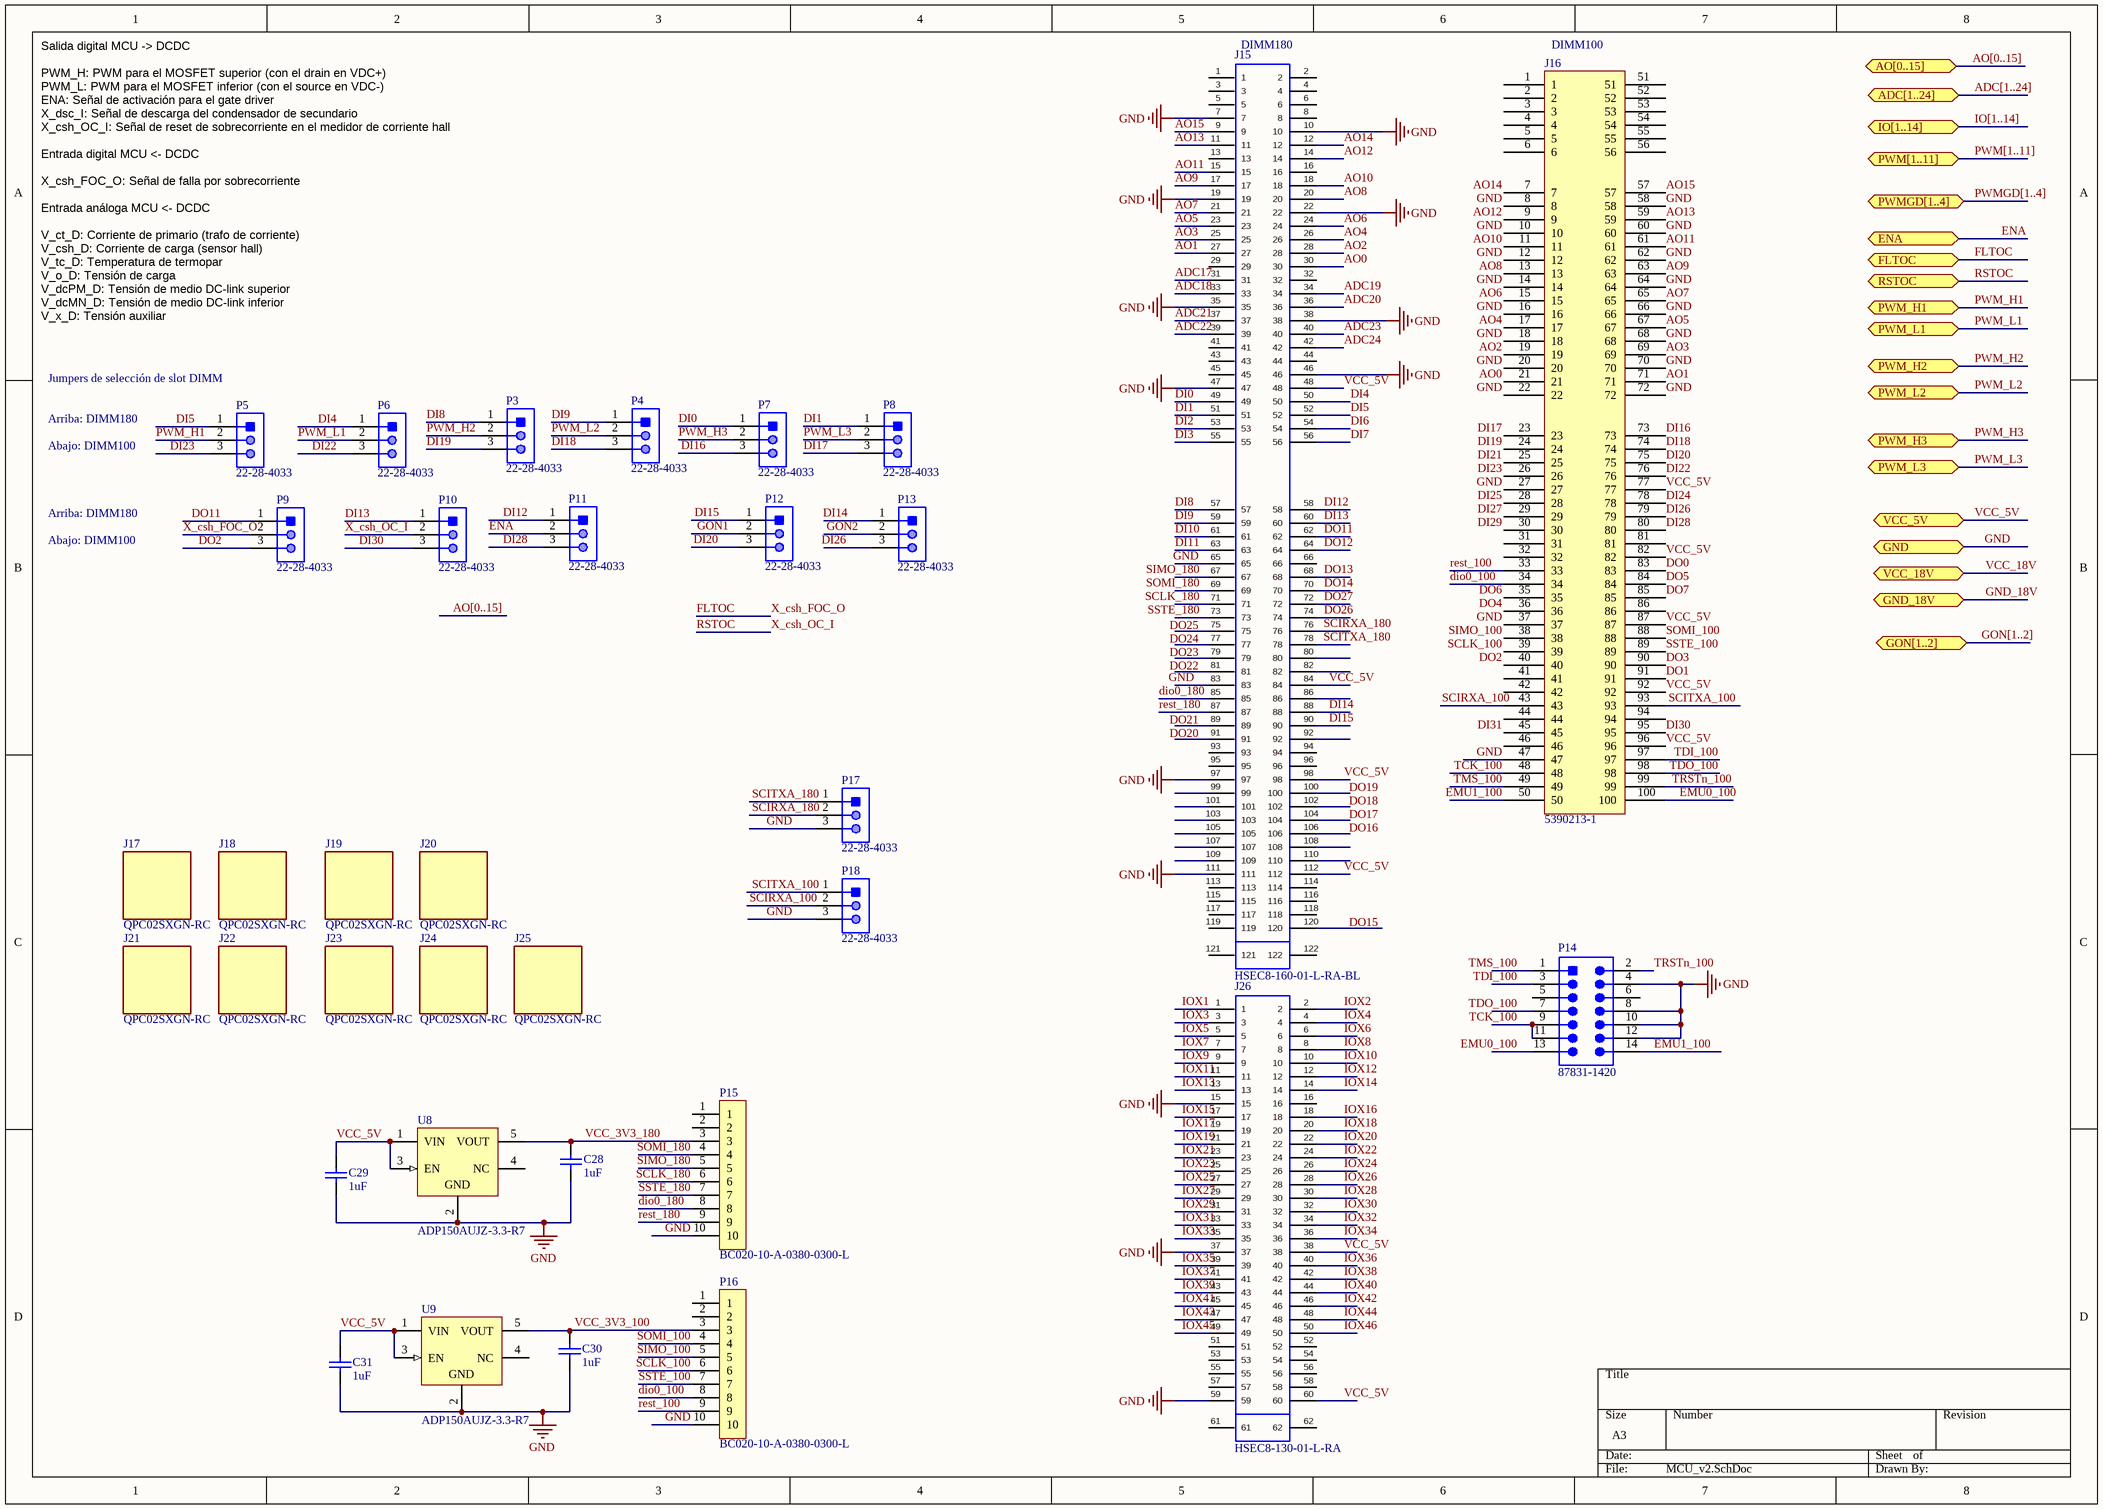
[diagram p3: MCU_v2.SchDoc]

### Parts
C28  value 1uF  [CAPC0603(1608)100_N]  (hidden comment: CAP 1uF 50V 0603(1608))
C29  value 1uF  [CAPC0603(1608)100_N]  (hidden comment: CAP 1uF 50V 0603(1608))
C30  value 1uF  [CAPC0603(1608)100_N]  (hidden comment: CAP 1uF 50V 0603(1608))
C31  value 1uF  [CAPC0603(1608)100_N]  (hidden comment: CAP 1uF 50V 0603(1608))
J15  HSEC8-160-01-L-RA-BL  [HSEC8-160-01-L-RA-BL]
J16  5390213-1  [TE_5390213-1]
J17  QPC02SXGN-RC  [FP-QPC02SXGN-RC-MFG]
J18  QPC02SXGN-RC  [FP-QPC02SXGN-RC-MFG]
J19  QPC02SXGN-RC  [FP-QPC02SXGN-RC-MFG]
J20  QPC02SXGN-RC  [FP-QPC02SXGN-RC-MFG]
J21  QPC02SXGN-RC  [FP-QPC02SXGN-RC-MFG]
J22  QPC02SXGN-RC  [FP-QPC02SXGN-RC-MFG]
J23  QPC02SXGN-RC  [FP-QPC02SXGN-RC-MFG]
J24  QPC02SXGN-RC  [FP-QPC02SXGN-RC-MFG]
J25  QPC02SXGN-RC  [FP-QPC02SXGN-RC-MFG]
J26  HSEC8-130-01-L-RA  [HSEC8-130-01-L-RA]
P3  22-28-4033  [MOLX-22-28-4033_V]
P4  22-28-4033  [MOLX-22-28-4033_V]
P5  22-28-4033  [MOLX-22-28-4033_V]
P6  22-28-4033  [MOLX-22-28-4033_V]
P7  22-28-4033  [MOLX-22-28-4033_V]
P8  22-28-4033  [MOLX-22-28-4033_V]
P9  22-28-4033  [MOLX-22-28-4033_V]
P10  22-28-4033  [MOLX-22-28-4033_V]
P11  22-28-4033  [MOLX-22-28-4033_V]
P12  22-28-4033  [MOLX-22-28-4033_V]
P13  22-28-4033  [MOLX-22-28-4033_V]
P14  87831-1420  [MOLEX-87831-1420_V]
P15  BC020-10-A-0380-0300-L  [BC020-10-A-0380-0300-L]
P16  BC020-10-A-0380-0300-L  [BC020-10-A-0380-0300-L]
P17  22-28-4033  [MOLX-22-28-4033_V]
P18  22-28-4033  [MOLX-22-28-4033_V]
U8  ADP150AUJZ-3.3-R7  [ADI-UJ-5_M]
U9  ADP150AUJZ-3.3-R7  [ADI-UJ-5_M]

### Ports
ADC[1..24] (bidir), AO[0..15] (bidir), ENA (bidir), FLTOC (bidir), GND (bidir), GND_18V (bidir), GON[1..2] (bidir), IO[1..14] (bidir), PWM[1..11] (bidir), PWM_H1 (bidir), PWM_H2 (bidir), PWM_H3 (bidir), PWM_L1 (bidir), PWM_L2 (bidir), PWM_L3 (bidir), PWMGD[1..4] (bidir), RSTOC (bidir), VCC_5V (bidir), VCC_18V (bidir)

### Nets
GND: C28.1 C29.1 C30.1 C31.1 J15.7 J15.10 J15.19 J15.22 J15.35 J15.38 J15.46 J15.47 J15.65 J15.83 J15.97 J15.111 J16.8 J16.10 J16.12 J16.14 J16.16 J16.18 J16.20 J16.22 J16.27 J16.37 J16.47 J16.58 J16.60 J16.62 J16.64 J16.66 J16.68 J16.70 J16.72 J26.15 J26.37 J26.59 P14.4 P14.8 P14.10 P14.12 P15.10 P16.10 P17.3 P18.3 U8.2(GND) U9.2(GND) ; port GND
VCC_5V: C29.2 C31.2 J15.48 J15.84 J15.98 J15.112 J16.77 J16.82 J16.87 J16.92 J16.96 J26.38 J26.60 U8.1(VIN) U8.3(EN) U9.1(VIN) U9.3(EN) ; port VCC_5V
ADC17: J15.31
ADC18: J15.33
ADC19: J15.34
ADC20: J15.36
ADC21: J15.37
ADC22: J15.39
ADC23: J15.40
ADC24: J15.42
AO0: J15.30 J16.21
AO1: J15.27 J16.71
AO2: J15.28 J16.19
AO3: J15.25 J16.69
AO4: J15.26 J16.17
AO5: J15.23 J16.67
AO6: J15.24 J16.15
AO7: J15.21 J16.65
AO8: J15.20 J16.13
AO9: J15.17 J16.63
AO10: J15.18 J16.11
AO11: J15.15 J16.61
AO12: J15.14 J16.9
AO13: J15.11 J16.59
AO14: J15.12 J16.7
AO15: J15.9 J16.57
DI0: J15.49 P7.1
DI1: J15.51 P8.1
DI2: J15.53
DI3: J15.55
DI4: J15.50 P6.1
DI5: J15.52 P5.1
DI6: J15.54
DI7: J15.56
DI8: J15.57 P3.1
DI9: J15.59 P4.1
DI10: J15.61
DI11: J15.63
DI12: J15.58 P11.1
DI13: J15.60 P10.1
DI14: J15.88 P13.1
DI15: J15.90 P12.1
DI16: J16.73 P7.3
DI17: J16.23 P8.3
DI18: J16.74 P4.3
DI19: J16.24 P3.3
DI20: J16.75 P12.3
DI21: J16.25
DI22: J16.76 P6.3
DI23: J16.26 P5.3
DI24: J16.78
DI25: J16.28
DI26: J16.79 P13.3
DI27: J16.29
DI28: J16.80 P11.3
DI29: J16.30
DI30: J16.95 P10.3
DI31: J16.45
dio0_100: J16.34 P16.8
dio0_180: J15.85 P15.8
DO0: J16.83
DO1: J16.91
DO2: J16.40 P9.3
DO3: J16.90
DO4: J16.36
DO5: J16.84
DO6: J16.35
DO7: J16.85
DO11: J15.62 P9.1
DO12: J15.64
DO13: J15.68
DO14: J15.70
DO26: J15.74
DO27: J15.72
EMU0_100: J16.100 P14.13
EMU1_100: J16.50 P14.14
ENA: P11.2 ; port ENA
FLTOC: P9.2 ; port FLTOC  [also labelled X_csh_FOC_O]
GON1: P12.2
GON2: P13.2  [project net Gon1]
IOX1: J26.1
IOX2: J26.2
IOX3: J26.3
IOX4: J26.4
IOX5: J26.5
IOX6: J26.6
IOX7: J26.7
IOX8: J26.8
IOX9: J26.9
IOX10: J26.10
IOX11: J26.11
IOX12: J26.12
IOX13: J26.13
IOX14: J26.14
IOX15: J26.17
IOX16: J26.18
IOX17: J26.19
IOX18: J26.20
IOX19: J26.21
IOX20: J26.22
IOX21: J26.23
IOX22: J26.24
IOX23: J26.25
IOX24: J26.26
IOX25: J26.27
IOX26: J26.28
IOX27: J26.29
IOX28: J26.30
IOX29: J26.31
IOX30: J26.32
IOX31: J26.33
IOX32: J26.34
IOX33: J26.35
IOX34: J26.36
IOX35: J26.39
IOX36: J26.40
IOX37: J26.41
IOX38: J26.42
IOX39: J26.43
IOX40: J26.44
IOX41: J26.45
IOX42: J26.46
IOX43: J26.47
IOX44: J26.48
IOX45: J26.49
IOX46: J26.50
PWM_H1: P5.2 ; port PWM_H1
PWM_H2: P3.2 ; port PWM_H2
PWM_H3: P7.2 ; port PWM_H3
PWM_L1: P6.2 ; port PWM_L1
PWM_L2: P4.2 ; port PWM_L2
PWM_L3: P8.2 ; port PWM_L3
rest_100: J16.33 P16.9
rest_180: J15.87 P15.9
RSTOC: P10.2 ; port RSTOC  [also labelled X_csh_OC_I]
SCIRXA_100: J16.43 P18.2
SCIRXA_180: J15.76 P17.2
SCITXA_100: J16.93 P18.1
SCITXA_180: J15.78 P17.1
SCLK_100: J16.39 P16.6
SCLK_180: J15.71 P15.6
SIMO_100: J16.38 P16.5
SIMO_180: J15.67 P15.5
SOMI_100: J16.88 P16.4
SOMI_180: J15.69 P15.4
SSTE_100: J16.89 P16.7
SSTE_180: J15.73 P15.7
TCK_100: J16.48 P14.9 P14.11
TDI_100: J16.97 P14.3
TDO_100: J16.98 P14.7
TMS_100: J16.49 P14.1
TRSTn_100: J16.99 P14.2
VCC_3V3_100: C30.2 P16.3 U9.5(VOUT)
VCC_3V3_180: C28.2 P15.3 U8.5(VOUT)

Not connected (* = marked no-connect by the designer): J15 1 2 3 4 5 6 8 13 16 29 32 41 43 44 45 66 75 77 79 80 81 82 86 89 91 92 93 94 95 96 99 100 101 102 103 104 105 106 107 108 109 110 113 114 115 116 117 118 119 120 121 122; J16 1 2 3 4 5 6 31 32 41 42 44 46 51 52 53 54 55 56 81 86 94; J26 16 51 52 53 54 55 56 57 58 61 62; P14 5 6; P15 1 2; P16 1 2; U8 4(NC); U9 4(NC)

### Buses and harness runs
bus ADC[1..24] = port ADC[1..24]
bus AO[0..15]
bus AO[0..15] = port AO[0..15]
bus GON[1..2] = port GON[1..2]
bus IO[1..14] = port IO[1..14]
bus PWM[1..11] = port PWM[1..11]
bus PWMGD[1..4] = port PWMGD[1..4]

### Notes on the sheet
- (near J15) DIMM180
- (near J16) DIMM100
- Salida digital MCU -> DCDC
  PWM_H: PWM para el MOSFET superior (con el drain en VDC+)
  PWM_L: PWM para el MOSFET inferior (con el source en VDC-)
  ENA: Señal de activación para el gate driver
  X_dsc_I: Señal de descarga del condensador de secundario
  X_csh_OC_I: Señal de reset de sobrecorriente en el medidor de corriente hall
  Entrada digital MCU <- DCDC
  X_csh_FOC_O: Señal de falla por sobrecorriente
  Entrada análoga MCU <- DCDC
  V_ct_D: Corriente de primario (trafo de corriente)
  V_csh_D: Corriente de carga (sensor hall)
  V_tc_D: Temperatura de termopar
  V_o_D: Tensión de carga
  V_dcPM_D: Tensión de medio DC-link superior
  V_dcMN_D: Tensión de medio DC-link inferior
  V_x_D: Tensión auxiliar
- (near P5) Jumpers de selección de slot DIMM
- Arriba: DIMM180
- Abajo: DIMM100
- Labels drawn without touching a wire or pin: DO15, DO16, DO17, DO18, DO19, DO20, DO21, DO22, DO23, DO24, DO25

### Library data of the parts
C28-C31 = CMP-1035-02746-1: as C1 on sheet SUBBOARD-voltage_sensors; Technology: SMT; Max Thickness: 1 mm; Rated Voltage: 50 V
J15 = HSEC8-160-01-L-RA-BL: Standard Card Edge Connectors 0.80 mm Edge Rate High-Speed Edge Card Connector, Vertical; Manufacturer: Samtec; Number of Contacts: 120; Pitch: 0.8mm; Supplier 1: Digi-Key; Manufacturer Part Number: HSEC8-160-01-L-RA-BL; RoHS: Yes; Category: Card Edge Connectors; Stock 1: 48; Pricing 1: 1=13.09000, 10=11.90000, 25=11.60240, 50=10.71000, 100=10.11500, 250=9.22252, 500=8.62750, 1000=7.91350, 2500=7.73500 (USD); Mount: Surface Mount; Contact Plating: Gold; Number of Rows: 2; Termination: Solder; Packaging: Bulk; Radiation Hardening: No; ComponentLink1URL: https://datasheet.ciiva.com/10927/hsec8-ra-10927470.pdf?src-supplier=Avnet; ComponentLink1Description: https://datasheet.ciiva.com/10927/hsec8-ra-10927470.pdf?src-supplier=Avnet; Supplier Part Number 1: SAM13312-ND
J16 = 5390213-1: 100 Position DIMM DRAM Socket Through Hole; Centerline_Pitch: 1.27 mm[.05 in]; MF: TE Connectivity; Number_of_Positions: 100; SnapEDA_Link: https://www.snapeda.com/parts/5390213-1/TE%20Connectivity%20AMP%20Connectors/view-part/781316/?ref=snap; MP: 5390213-1; TE_purchase_URL: https://www.te.com/usa-en/product-5390213-1.html?te_bu=Cor&te_type=disp&te_campaign=seda_glo_cor-seda-global-disp-prtnr-fy19-seda-model-bom-cta_sma-317_1&elqCampaignId=32493; Availability: Unavailable; EU_RoHS_Compliance: Compliant; Price: None; Product_Type: Socket; Package: None; Value: *; Supplier 1: Newark; Supplier 2: Digi-Key; Supplier 3: Mouser; Supplier Part Number 1: 42K7163; Supplier Part Number 2: A121375-ND; Supplier Part Number 3: 571-5390213-1
J17-J25 = CMP-25666-000001-1: CONN JUMPER SHORTING .100" GOLD; Manufacturer: Sullins; Conn Orientation: Straight; Pitch: 2.54mm; Current Rating: 3A; Number Of Contacts: 2; Category: Conn; Temperature Range Low: -40°C; Temperature Range High: +85°C; Device Class L1: Connectors; Lead Free: Yes; Manufacturer Part Number: QPC02SXGN-RC; Automotive: No; Height: 6.17mm; ComponentLink2URL: https://s3.amazonaws.com/catalogspreads-pdf/PAGE128-129%20.100%20JUMPER.pdf; Device Class L2: unset; Footprint Url: https://drawings-pdf.s3.amazonaws.com/11510.pdf; Device Class L3: unset; Temperature: -40°C to +85°C; RoHS: TRUE; Digikey Description: CONN JUMPER SHORTING .100" GOLD; Octopart: https://octopart.com/qpc02sxgn-rc-sullins-19878795; Package: 0; ComponentLink2Description: Datasheet; Contact Material: Gold
J26 = HSEC8-130-01-L-RA: SAMTEC - HSEC8-130-01-L-RA - CARD EDGE CONN, DUAL SIDE, 60POS, SMD; Number of Contacts: 60; Pitch: 0.8mm; Supplier 1: Digi-Key; Manufacturer: Samtec; Manufacturer Part Number: HSEC8-130-01-L-RA; RoHS: Yes; Category: Card Edge Connectors; Stock 1: 105; Pricing 1: 1=8.35000, 10=8.00400, 25=7.30800, 50=6.96000, 100=6.61200, 250=5.91600, 500=5.56800, 1000=4.87200, 2500=4.62840 (USD); Mount: Surface Mount; Contact Plating: Gold; Termination: Solder; Packaging: Bulk; Number of Rows: 2; Radiation Hardening: No; ComponentLink1URL: https://datasheet.ciiva.com/3101/hsec8-ra-3101230.pdf?src-supplier=Avnet; ComponentLink1Description: https://datasheet.ciiva.com/3101/hsec8-ra-3101230.pdf?src-supplier=Avnet; Supplier Part Number 1: SAM12638-ND
P3-P13 P17 P18 = CMP-1676-00001-5: Male Header, Pitch 2.54 mm, 1 x 3 Position, Height 8.38 mm, Tail Length 3.18 mm, RoHS, Bulk; Manufacturer: Molex; Rows: 1; Voltage Rating: 250 V; Current Rating: 4 A; Min Operating Temperature: 0 degC; Lead Pitch: 0.1 inch; Packaging: Bulk; Contact Finish: Gold; RoHSCompliant: true; Contact Material: Brass; PackageReference: 22-28-4033; REACH SVHC: Unknown; PackageDescription: Male Header, Pitch 2.54 mm, 1 x 3 Position, Height 8.38 mm, Tail Length 3.18 mm; ComponentLink2URL: http://www.molex.com/pdm_docs/sd/022284033_sd.pdf; Height: 8.38 mm; Mounting Technology: Through Hole; ComponentLink1Description: Manufacturer URL; Length: 7.62 mm; Mount: Through Hole; DatasheetVersion: Rev. G, 01/2012; Max Operating Temperature: 75 degC; ComponentLink2Description: Datasheet; Colour: Black; Pins: 3; Contact Plating: Gold; Package Quantity: 1; ComponentLink1URL: http://www.molex.com/
P14 = CMP-2000-05240-1: Header, Pitch 2 mm, 2 x 7 Position, Height 6.4 mm, Tail Length 2.5 mm, -55 to 105 degC, RoHS, Tube; Number of Positions / Contacts: 14; Current Rating: 2A; Brand: Molex; Mounting Angle: Vertical; Pitch: 2mm; Voltage Rating: 125V; Datasheet Version: Rev. E, 04/2006; Housing Material: Thermoplastic; Contact Material: Brass; Datasheet URL: https://datasheet.ciiva.com/27096/1934585-27096088.pdf; Type: Shrouded; Number of Positions: 14; Mounting Style: ThroughHole; Product Category: Headers&WireHousings; RoHS: Details; Factory Pack Quantity: 3200; Contact Plating: Gold; Series: 87831; Number of Rows: 2; Manufacturer: Molex; Product Type: Headers; Termination Style: ThroughHole; Packaging: Tube; Tradename: Milli-Grid; Manufacturer URL: http://www.molex.com/
P15 P16 = BC020-10-A-0380-0300-L: BOARD-BOARD CONNECTOR, HEADER, 10WAY, 1ROW; Product Range:BC020 Series; Contact Termination Type:Through Hole; Gender:Header; No. of Contacts:10; Pitch Spacing:1mm; Contact Plating:Gold Plated Contacts; Contact Material:Copper Alloy ;RoHS Compliant: Yes; Manufacturer: Global Connector Technology; Gender: Male; Number of Contacts: 10; Manufacturer Part Number: BC020-10-A-0380-0300-L; RoHS: Yes; Category: Connectors; Stock 1: 1113; Pricing 1: 1=0,66300, 10=0,66300, 25=0,66300, 50=0,66300, 100=0,66300, 250=0,66300, 500=0,66300, 1000=0,66300 (USD); Mount: Through Hole; Contact Plating: Gold; Contact Material: Copper Alloy; Termination: Through Hole; Number of Rows: 1; REACH SVHC: No SVHC; ComponentLink1URL: http://www.farnell.com/datasheets/2342914.pdf?src-supplier=Farnell; ComponentLink1Description: http://www.farnell.com/datasheets/2342914.pdf?src-supplier=Farnell; ComponentLink2URL: http://www.farnell.com/datasheets/682675.pdf?src-supplier=Farnell; ComponentLink2Description: http://www.farnell.com/datasheets/682675.pdf?src-supplier=Farnell; ComponentLink3URL: http://www.farnell.com/datasheets/682675.pdf?src-supplier=Element14; ComponentLink3Description: http://www.farnell.com/datasheets/682675.pdf?src-supplier=Element14; Supplier 1: Newark; Supplier 2: Farnell; Supplier 3: Newark; Supplier Part Number 1: 67R6873; Supplier Part Number 2: 2577320; Supplier Part Number 3: 42AC9863; System: Connector
U8 U9 = CMP-0786-00394-1: Ultralow Noise, 150 mA CMOS Linear Regulator, 2.2 to 5.5 V Vin, 3.3 V Vout, Industrial, 5-pin SOT23 (UJ-5), Reel; Manufacturer: Analog Devices; Supply Current IGND @ Small Load: 10uA; Vin (min) (V): 2.2; Iout max: 150mA; Preset Vout Values (V): 3.3; Vin (max) (V): 5.5; ComponentLink2Description: Datasheet; PackageReference: UJ-5; DatasheetVersion: Rev. A; PackageDescription: 5-Pin Thin Small Outline Transistor Package, Body 2.9 x 1.6 mm, Pitch 0.95 mm; ComponentLink4URL: Product URL:http://www.analog.com/en/ADP150/productSearch.html; Packing: Reel; ComponentLink1URL: http://www.analog.com/en/index.html; PartNumber: ADP150AUJZ-3.3-R7; PackageVersion: 100708-A, 10/2008; ComponentLink3Description: Package Specification; ComponentLink3URL: http:/www.analog.com/static/imported-files/packages/PKG_PDF/TSOT(UJ)/UJ_5.pdf; ComponentLink4Description: URL Link1; ComponentLink2URL: http://www.analog.com/static/imported-files/data_sheets/ADP150.pdf; Code_JEDEC: MO-193-AB; Mounting Technology: Surface Mount; ComponentLink1Description: Manufacturer URL

## Sheet thermocouple.SchDoc
size A4
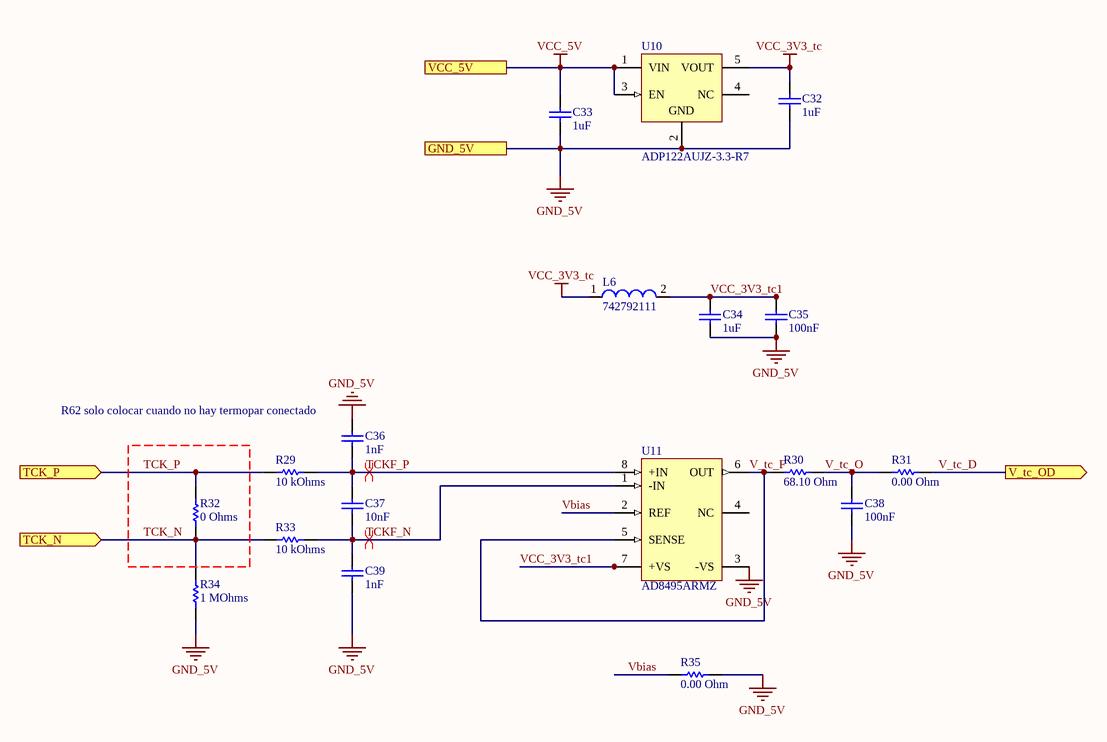
[diagram p4: thermocouple.SchDoc]

### Parts
C32  value 1uF  [CAPC0603(1608)100_N]  (hidden comment: CAP 1uF 50V 0603(1608))
C33  value 1uF  [CAPC0603(1608)100_N]  (hidden comment: CAP 1uF 50V 0603(1608))
C34  value 1uF  [CAPC0603(1608)100_L]  (hidden comment: CAP 1uF 50V 0603(1608))
C35  value 100nF  [CAPC0603(1608)100_L]  (hidden comment: CAP 100nF 50V 0603(1608))
C36  value 1nF  [CAPC0603(1608)100_L]  (hidden comment: CAP 1nF 25V 0603(1608))
C37  value 10nF  [CAPC0603(1608)100_L]  (hidden comment: CAP 10nF 25V 0603(1608))
C38  value 100nF  [CAPC0603(1608)100_N]  (hidden comment: CAP 100nF 10V 0603(1608))
C39  value 1nF  [CAPC0603(1608)100_L]  (hidden comment: CAP 1nF 25V 0603(1608))
L6  742792111  [SMD-1206]
R29  value 10 kOhms  [RESC3116X65X50NL20T20]  (hidden comment: CRCW120610K0FKEAHP)
R30  value 68.10 Ohm  [RESC0805(2012)_N]  (hidden comment: 68R1 1% 0805(2012))
R31  value 0.00 Ohm  [RESC0603(1608)_N]  (hidden comment: Jumper 0603(1608))
R32  value 0 Ohms  [RESC3216X60X45LL10T20]  (hidden comment: CRCW12060000Z0EB)
R33  value 10 kOhms  [RESC3116X65X50NL20T20]  (hidden comment: CRCW120610K0FKEAHP)
R34  value 1 MOhms  [RESC3216X70X50LL05T20]  (hidden comment: ERJ-8GEYJ105V)
R35  value 0.00 Ohm  [RESC0603(1608)_L]  (hidden comment: Jumper 0603(1608))
U10  ADP122AUJZ-3.3-R7  [ADI-UJ-5_L]
U11  AD8495ARMZ  [DGK0008A_L]

### Ports
GND_5V, TCK_N (in), TCK_P (in), V_tc_OD (out), VCC_5V

### Nets
GND_5V: C32.1 C33.1 C34.1 C35.1 C36.1 C38.1 C39.2 R34.1 R35.2 U10.2(GND) U11.3(-VS) ; port GND_5V  [project net GND]
VCC_3V3_tc: C32.2 L6.1 U10.5(VOUT)
VCC_5V: C33.2 U10.1(VIN) U10.3(EN) ; port VCC_5V
TCK_N: R32.1 R33.2 R34.2 ; port TCK_N
TCK_P: R29.2 R32.2 ; port TCK_P
TCKF_N: C37.2 C39.1 R33.1 U11.1(-IN)
TCKF_P: C36.2 C37.1 R29.1 U11.8(+IN)
V_tc_D: R31.1 ; port V_tc_OD  [project net AO0]
V_tc_F: R30.2 U11.5(SENSE) U11.6(OUT)
V_tc_O: C38.2 R30.1 R31.2
Vbias: R35.1 U11.2(REF)
VCC_3V3_tc1: C34.2 C35.2 L6.2 U11.7(+VS)

Not connected (* = marked no-connect by the designer): U10 4(NC); U11 4(NC)

### Layout directives
differential pair: TCKF_N, TCKF_P

### Notes on the sheet
- (near C36) R62 solo colocar cuando no hay termopar conectado

### Library data of the parts
C32-C34 = CMP-1035-02746-1: as C1 on sheet SUBBOARD-voltage_sensors; Technology: SMT; Max Thickness: 1 mm; Rated Voltage: 50 V
C35 = CMP-1035-02591-1: CAP 100nF 50V ±5% 0603 (1608 Metric) Thickness 1mm SMD; Tolerance: Â±5%; Case-Metric: 1608; Case-EIA: 0603; Rated Voltage: 50 V; Max Thickness: 1 mm; Technology: SMT
C36 C39 = CMP-1035-01883-1: CAP 1nF 25V ±5% 0603 (1608 Metric) Thickness 1mm SMD; Case-EIA: 0603; Tolerance: Â±5%; Case-Metric: 1608; Technology: SMT; Rated Voltage: 25 V; Max Thickness: 1 mm
C37 = CMP-1035-02316-1: CAP 10nF 25V ±5% 0603 (1608 Metric) Thickness 1mm SMD; Tolerance: Â±5%; Case-EIA: 0603; Case-Metric: 1608; Rated Voltage: 25 V; Technology: SMT; Max Thickness: 1 mm
C38 = CMP-1035-02580-1: as C11 on sheet voltage_sensor_HiZ_LV_OpAmp; Max Thickness: 1 mm; Rated Voltage: 10 V; Technology: SMT
L6 = CMP-0220-00024-1: as L1 on sheet SUBBOARD-voltage_sensors; ComponentLink2Description: Datasheet; PackageReference: SMD-1206; ComponentLink2URL: http://www.we-online.de/katalog/media/pdf/742792111.pdf; PackageVersion: 2007; DatasheetVersion: Dec-2005; PackageDescription: Chip Inductor, 2-Leads, Body 3.2 x 1.6 mm; ComponentLink1URL: http://www.we-online.com; ComponentLink1Description: Manufacturer Link
R29 R33 = CMP-2003-04883-1: Manufacturer: Vishay Dale; Precision: 1%; Part Number: CRCW120610K0FKEAHP; Package: 1206
R30 = CMP-1013-00379-1: 68R1 0.125W 1% 0805 (2012 Metric)  SMD; Case-EIA: 0805; Case-Metric: 2012; Power: 0.125 W; Tolerance: 1 %; Technology: SMT
R31 R35 = CMP-1012-00001-1: as R8 on sheet voltage_sensor_HiZ_LV_OpAmp; Technology: SMT; Tolerance: None
R32 = CMP-2003-04797-1: Manufacturer: Vishay Dale; Part Number: CRCW12060000Z0EB; Package: 1206
R34 = CMP-2003-00547-1: Manufacturer: Panasonic; Precision: 5%; Part Number: ERJ-8GEYJ105V; Package: 1206
U10 = CMP-0786-00346-1: as U1 on sheet SUBBOARD-voltage_sensors; ComponentLink4Description: URL Link1; ComponentLink4URL: Product URL:http://www.analog.com/en/ADP122/productSearch.html; ComponentLink2URL: http://www.analog.com/static/imported-files/data_sheets/ADP122_123.pdf; PackageDescription: 5-Pin Thin Small Outline Transistor Package, Body 2.9 x 1.6 mm, Pitch 0.95 mm; ComponentLink1URL: http://www.analog.com/en/index.html; ComponentLink3URL: http:/www.analog.com/static/imported-files/packages/PKG_PDF/TSOT(UJ)/UJ_5.pdf; ComponentLink2Description: Datasheet; PartNumber: ADP122AUJZ-3.3-R7; Packing: Reel; ComponentLink1Description: Manufacturer URL; Code_JEDEC: MO-193-AB; PackageVersion: 100708-A, 10/2008; PackageReference: UJ-5; Mounting Technology: Surface Mount; DatasheetVersion: Rev. E; ComponentLink3Description: Package Specification
U11 = AD8495ARMZ: Full K-Type Thermocouple Amplifier with Cold Junction Compensation, Industrial, 8-pin SOP (RM-8), Tube; Manufacturer: Analog Devices; ComponentLink3URL: http://www.analog.com/static/imported-files/packages/PKG_PDF/MSOP%28RM%29/RM_8.pdf; ComponentLink4URL: http://www.analog.com/en/mems-sensors/digital-temperature-sensors/ad8495/products/product.html; ComponentLink1URL: http://www.analog.com/en/index.html; PartNumber: AD8495ARMZ; PackageVersion: 08/2005; PackageReference: RM-8; PackageDescription: 8-Pin Mini Small Outline Package, Body 3 x 3 mm, Pitch 0.65 mm; ComponentLink1Description: Manufacturer URL; Code_JEDEC: MO-187-AA; ComponentLink2URL: http://www.analog.com/static/imported-files/data_sheets/AD8494_8495_8496_8497.pdf; Mounting Technology: Surface Mount; ComponentLink4Description: Product URL; ComponentLink3Description: Package Specification; Packing: Tube; ComponentLink2Description: Datasheet; DatasheetVersion: Rev. C; Supplier 1: Digi-Key; Supplier 2: Arrow; Supplier 3: Mouser; Supplier 4: Farnell; Supplier Part Number 1: AD8495ARMZ-ND; Supplier Part Number 2: AD8495ARMZ; Supplier Part Number 3: 584-AD8495ARMZ; Supplier Part Number 4: 1864707